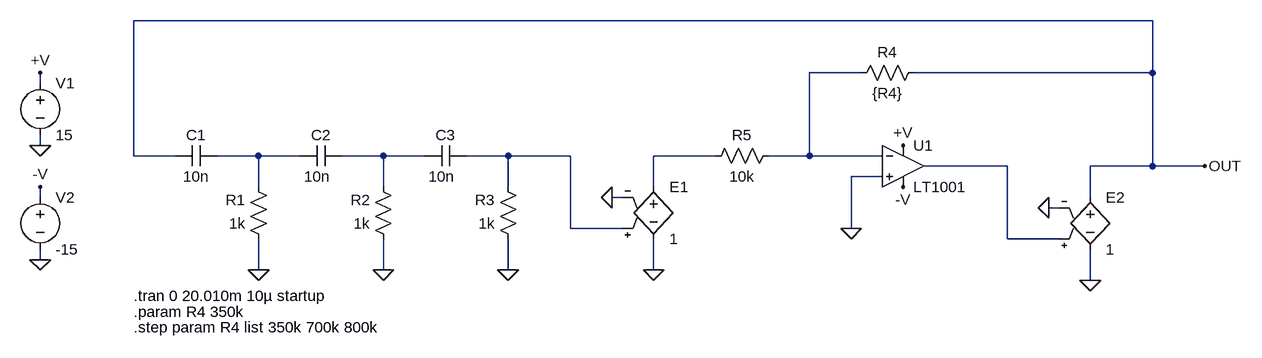
[diagram p0: schematic 06-rc-phase-shift-oscillator.asc]
06-rc-phase-shift-oscillator.asc, the LTspice schematic file:
Version 4.1
SHEET 1 1140 1108
WIRE 992 176 -576 176
WIRE 544 256 464 256
WIRE 992 256 992 176
WIRE 992 256 624 256
WIRE -720 272 -720 256
WIRE -720 368 -720 352
WIRE -576 384 -576 176
WIRE -512 384 -576 384
WIRE -384 384 -448 384
WIRE -320 384 -384 384
WIRE -192 384 -256 384
WIRE -128 384 -192 384
WIRE 0 384 -64 384
WIRE 96 384 0 384
WIRE 320 384 224 384
WIRE 464 384 464 256
WIRE 464 384 400 384
WIRE 576 384 464 384
WIRE 768 400 640 400
WIRE 992 400 992 256
WIRE 992 400 896 400
WIRE 1072 400 992 400
WIRE 576 416 528 416
WIRE -384 432 -384 384
WIRE -192 432 -192 384
WIRE 0 432 0 384
WIRE 224 432 224 384
WIRE -720 448 -720 432
WIRE 176 448 160 448
WIRE 896 448 896 400
WIRE 848 464 832 464
WIRE 96 496 96 384
WIRE 176 496 96 496
WIRE 528 496 528 416
WIRE 768 512 768 400
WIRE 848 512 768 512
WIRE -720 544 -720 528
WIRE -384 560 -384 512
WIRE -192 560 -192 512
WIRE 0 560 0 512
WIRE 224 560 224 512
WIRE 896 576 896 528
FLAG 608 368 +V
FLAG 608 432 -V
FLAG -720 256 +V
FLAG -720 544 0
FLAG -720 368 0
FLAG -720 432 -V
FLAG -384 560 0
FLAG 1072 400 OUT
FLAG 528 496 0
FLAG -192 560 0
FLAG 0 560 0
FLAG 160 448 0
FLAG 224 560 0
FLAG 832 464 0
FLAG 896 576 0
SYMBOL voltage -720 256 R0
SYMATTR InstName V1
SYMATTR Value 15
SYMBOL voltage -720 432 R0
SYMATTR InstName V2
SYMATTR Value -15
SYMBOL res -368 528 R180
WINDOW 0 36 76 Left 2
WINDOW 3 36 40 Left 2
SYMATTR InstName R1
SYMATTR Value 1k
SYMBOL cap -256 368 R90
WINDOW 0 0 32 VBottom 2
WINDOW 3 32 38 VTop 2
SYMATTR InstName C2
SYMATTR Value 10n
SYMBOL res -176 528 R180
WINDOW 0 36 76 Left 2
WINDOW 3 36 40 Left 2
SYMATTR InstName R2
SYMATTR Value 1k
SYMBOL cap -448 368 R90
WINDOW 0 0 32 VBottom 2
WINDOW 3 32 32 VTop 2
SYMATTR InstName C1
SYMATTR Value 10n
SYMBOL cap -64 368 R90
WINDOW 0 0 32 VBottom 2
WINDOW 3 32 38 VTop 2
SYMATTR InstName C3
SYMATTR Value 10n
SYMBOL res 528 272 R270
WINDOW 0 32 56 VTop 2
WINDOW 3 0 56 VBottom 2
SYMATTR InstName R4
SYMATTR Value {R4}
SYMBOL res 304 400 R270
WINDOW 0 32 56 VTop 2
WINDOW 3 0 56 VBottom 2
SYMATTR InstName R5
SYMATTR Value 10k
SYMBOL res 16 528 R180
WINDOW 0 36 76 Left 2
WINDOW 3 36 40 Left 2
SYMATTR InstName R3
SYMATTR Value 1k
SYMBOL OpAmps\\LT1001 608 336 R0
SYMATTR InstName U1
SYMBOL e2 224 416 R0
SYMATTR InstName E1
SYMATTR Value 1
SYMBOL e2 896 432 R0
SYMATTR InstName E2
SYMATTR Value 1
TEXT -576 600 Left 2 !.tran 0 20.010m 10µ startup
TEXT -576 624 Left 2 !.param R4 350k
TEXT -576 648 Left 2 !.step param R4 list 350k 700k 800k

The netlist it stands for:
* 06-rc-phase-shift-oscillator.asc
V1 +V 0 15
V2 -V 0 -15
R1 0 N002 1k
C2 N003 N002 10n
R2 0 N003 1k
C1 N002 OUT 10n
C3 N004 N003 10n
R4 N001 OUT {R4}
R5 N005 N001 10k
R3 0 N004 1k
X§U1 0 N001 +V -V N006 LT1001  ; pins In+ In- V+ V- OUT
E1 N005 0 N004 0 1
E2 OUT 0 N006 0 1
.tran 0 20.010m 10µ startup
.param R4 350k
.step param R4 list 350k 700k 800k
.lib LTC.lib
.backanno
.end